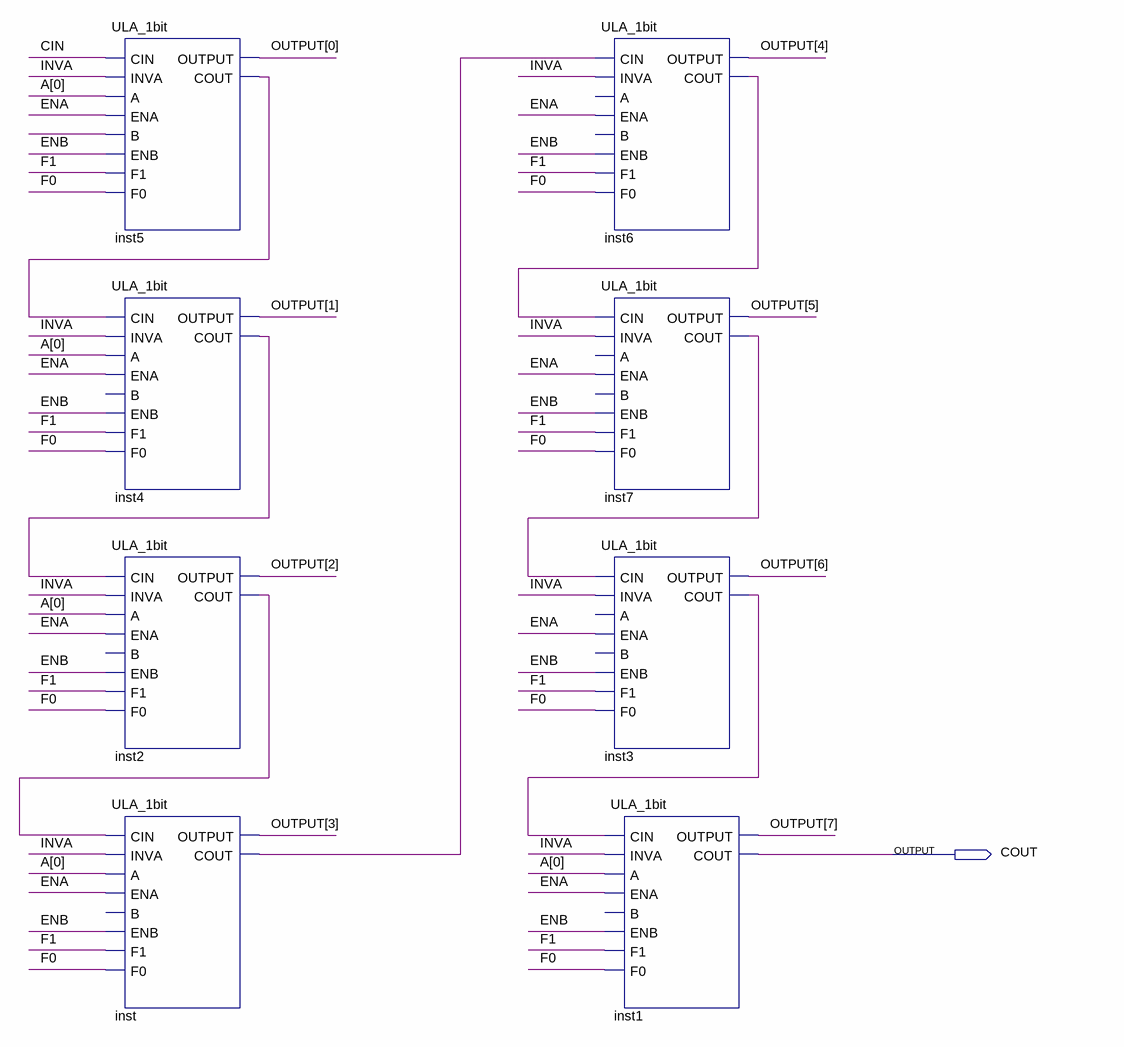
[diagram p0: schematic sheet]
// Quartus schematic ULA_8bit.bdf as structural Verilog: 8 symbols, 1 pins
module ULA_8bit (
  output COUT
);

  wire CIN, ENA, ENB, F0, F1, inst2_cout, inst3_cout, inst4_cout, inst5_cout, inst6_cout, inst7_cout,
       inst_cout, INVA, undriven;
  wire [0:0] A;
  wire [7:0] OUTPUT;

  ULA_1bit inst5 (
    .CIN(CIN), .INVA(INVA), .A(A[0]), .ENA(ENA), .B(undriven), .ENB(ENB), .F1(F1), .F0(F0),
    .OUTPUT(OUTPUT[0]), .COUT(inst5_cout));
  ULA_1bit inst4 (
    .CIN(inst5_cout), .INVA(INVA), .A(A[0]), .ENA(ENA), .ENB(ENB), .F1(F1), .F0(F0), .OUTPUT(OUTPUT[1]),
    .COUT(inst4_cout));  // open: B
  ULA_1bit inst2 (
    .CIN(inst4_cout), .INVA(INVA), .A(A[0]), .ENA(ENA), .ENB(ENB), .F1(F1), .F0(F0), .OUTPUT(OUTPUT[2]),
    .COUT(inst2_cout));  // open: B
  ULA_1bit inst (
    .CIN(inst2_cout), .INVA(INVA), .A(A[0]), .ENA(ENA), .ENB(ENB), .F1(F1), .F0(F0), .OUTPUT(OUTPUT[3]),
    .COUT(inst_cout));  // open: B
  ULA_1bit inst6 (
    .CIN(inst_cout), .INVA(INVA), .ENA(ENA), .ENB(ENB), .F1(F1), .F0(F0), .OUTPUT(OUTPUT[4]),
    .COUT(inst6_cout));  // open: A, B
  ULA_1bit inst7 (
    .CIN(inst6_cout), .INVA(INVA), .ENA(ENA), .ENB(ENB), .F1(F1), .F0(F0), .OUTPUT(OUTPUT[5]),
    .COUT(inst7_cout));  // open: A, B
  ULA_1bit inst3 (
    .CIN(inst7_cout), .INVA(INVA), .ENA(ENA), .ENB(ENB), .F1(F1), .F0(F0), .OUTPUT(OUTPUT[6]),
    .COUT(inst3_cout));  // open: A, B
  ULA_1bit inst1 (
    .CIN(inst3_cout), .INVA(INVA), .A(A[0]), .ENA(ENA), .ENB(ENB), .F1(F1), .F0(F0), .OUTPUT(OUTPUT[7]),
    .COUT(COUT));  // open: B
endmodule
